# Altium schematic sheet precharge.SchDoc: Precharge
size A4; Engineer: Shelby Riggleman; Organization: Badgerloop Electrical; Address1: 133 Engineering Research Building; Address2: 1500 Engineering Drive; Address3: Madison, Wi 53706; Revision: 1; SheetNumber: 1
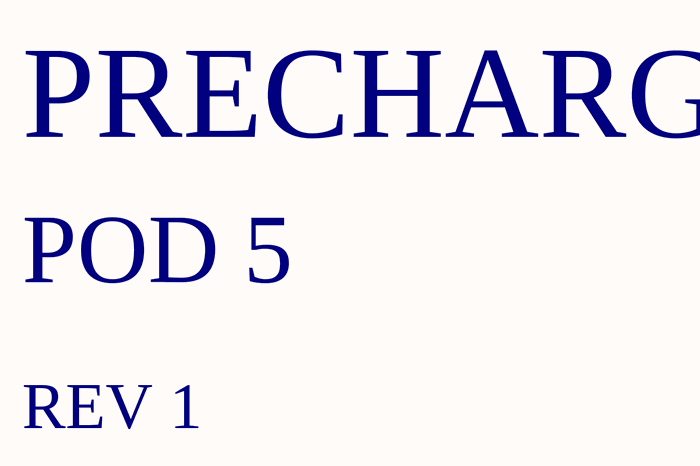
[diagram p0: precharge.SchDoc]

## Notes on the sheet
- PRECHARGE
- POD 5
- REV 1
- Title
- Engineer:
- Date:
- Time:
- Revision:
- Sheet
- of
- File: